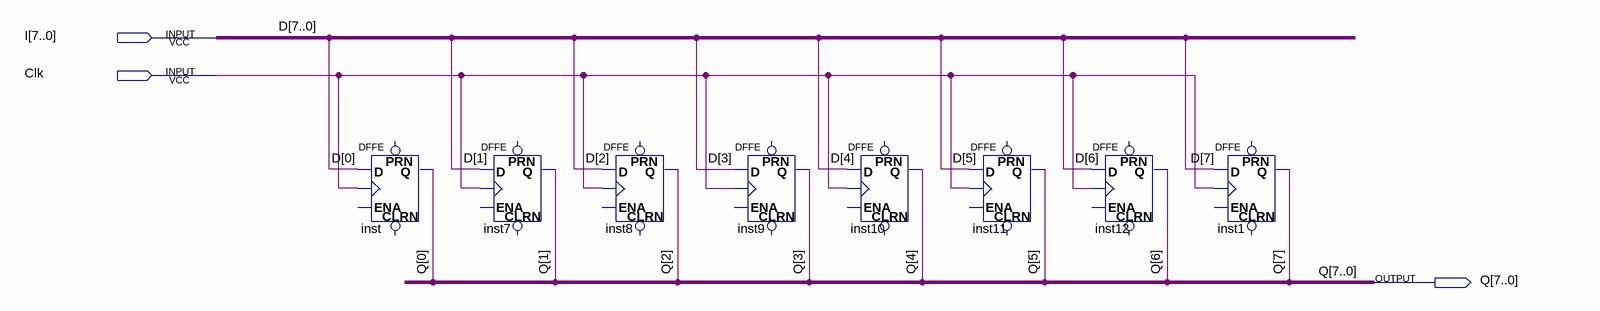
[diagram p0: schematic sheet]
// Quartus schematic Register_8bit.bdf as structural Verilog: 8 symbols, 3 pins
module Register_8bit (
  input  [7:0] I,
  input  Clk,
  output [7:0] Q
);

  DFFE inst (.D(I[0]), .CLK(Clk), .Q(Q[0]));  // open: PRN, CLRN, ENA
  DFFE inst7 (.D(I[1]), .CLK(Clk), .Q(Q[1]));  // open: PRN, CLRN, ENA
  DFFE inst8 (.D(I[2]), .CLK(Clk), .Q(Q[2]));  // open: PRN, CLRN, ENA
  DFFE inst9 (.D(I[3]), .CLK(Clk), .Q(Q[3]));  // open: PRN, CLRN, ENA
  DFFE inst10 (.D(I[4]), .CLK(Clk), .Q(Q[4]));  // open: PRN, CLRN, ENA
  DFFE inst11 (.D(I[5]), .CLK(Clk), .Q(Q[5]));  // open: PRN, CLRN, ENA
  DFFE inst12 (.D(I[6]), .CLK(Clk), .Q(Q[6]));  // open: PRN, CLRN, ENA
  DFFE inst1 (.D(I[7]), .CLK(Clk), .Q(Q[7]));  // open: PRN, CLRN, ENA

  // Other names for the same wires on the sheet: D[7:0] = I
endmodule
